# Altium schematic sheet Buck_5V_line_07.SchDoc
size A2; SheetNumber: 6; SheetTotal: 9
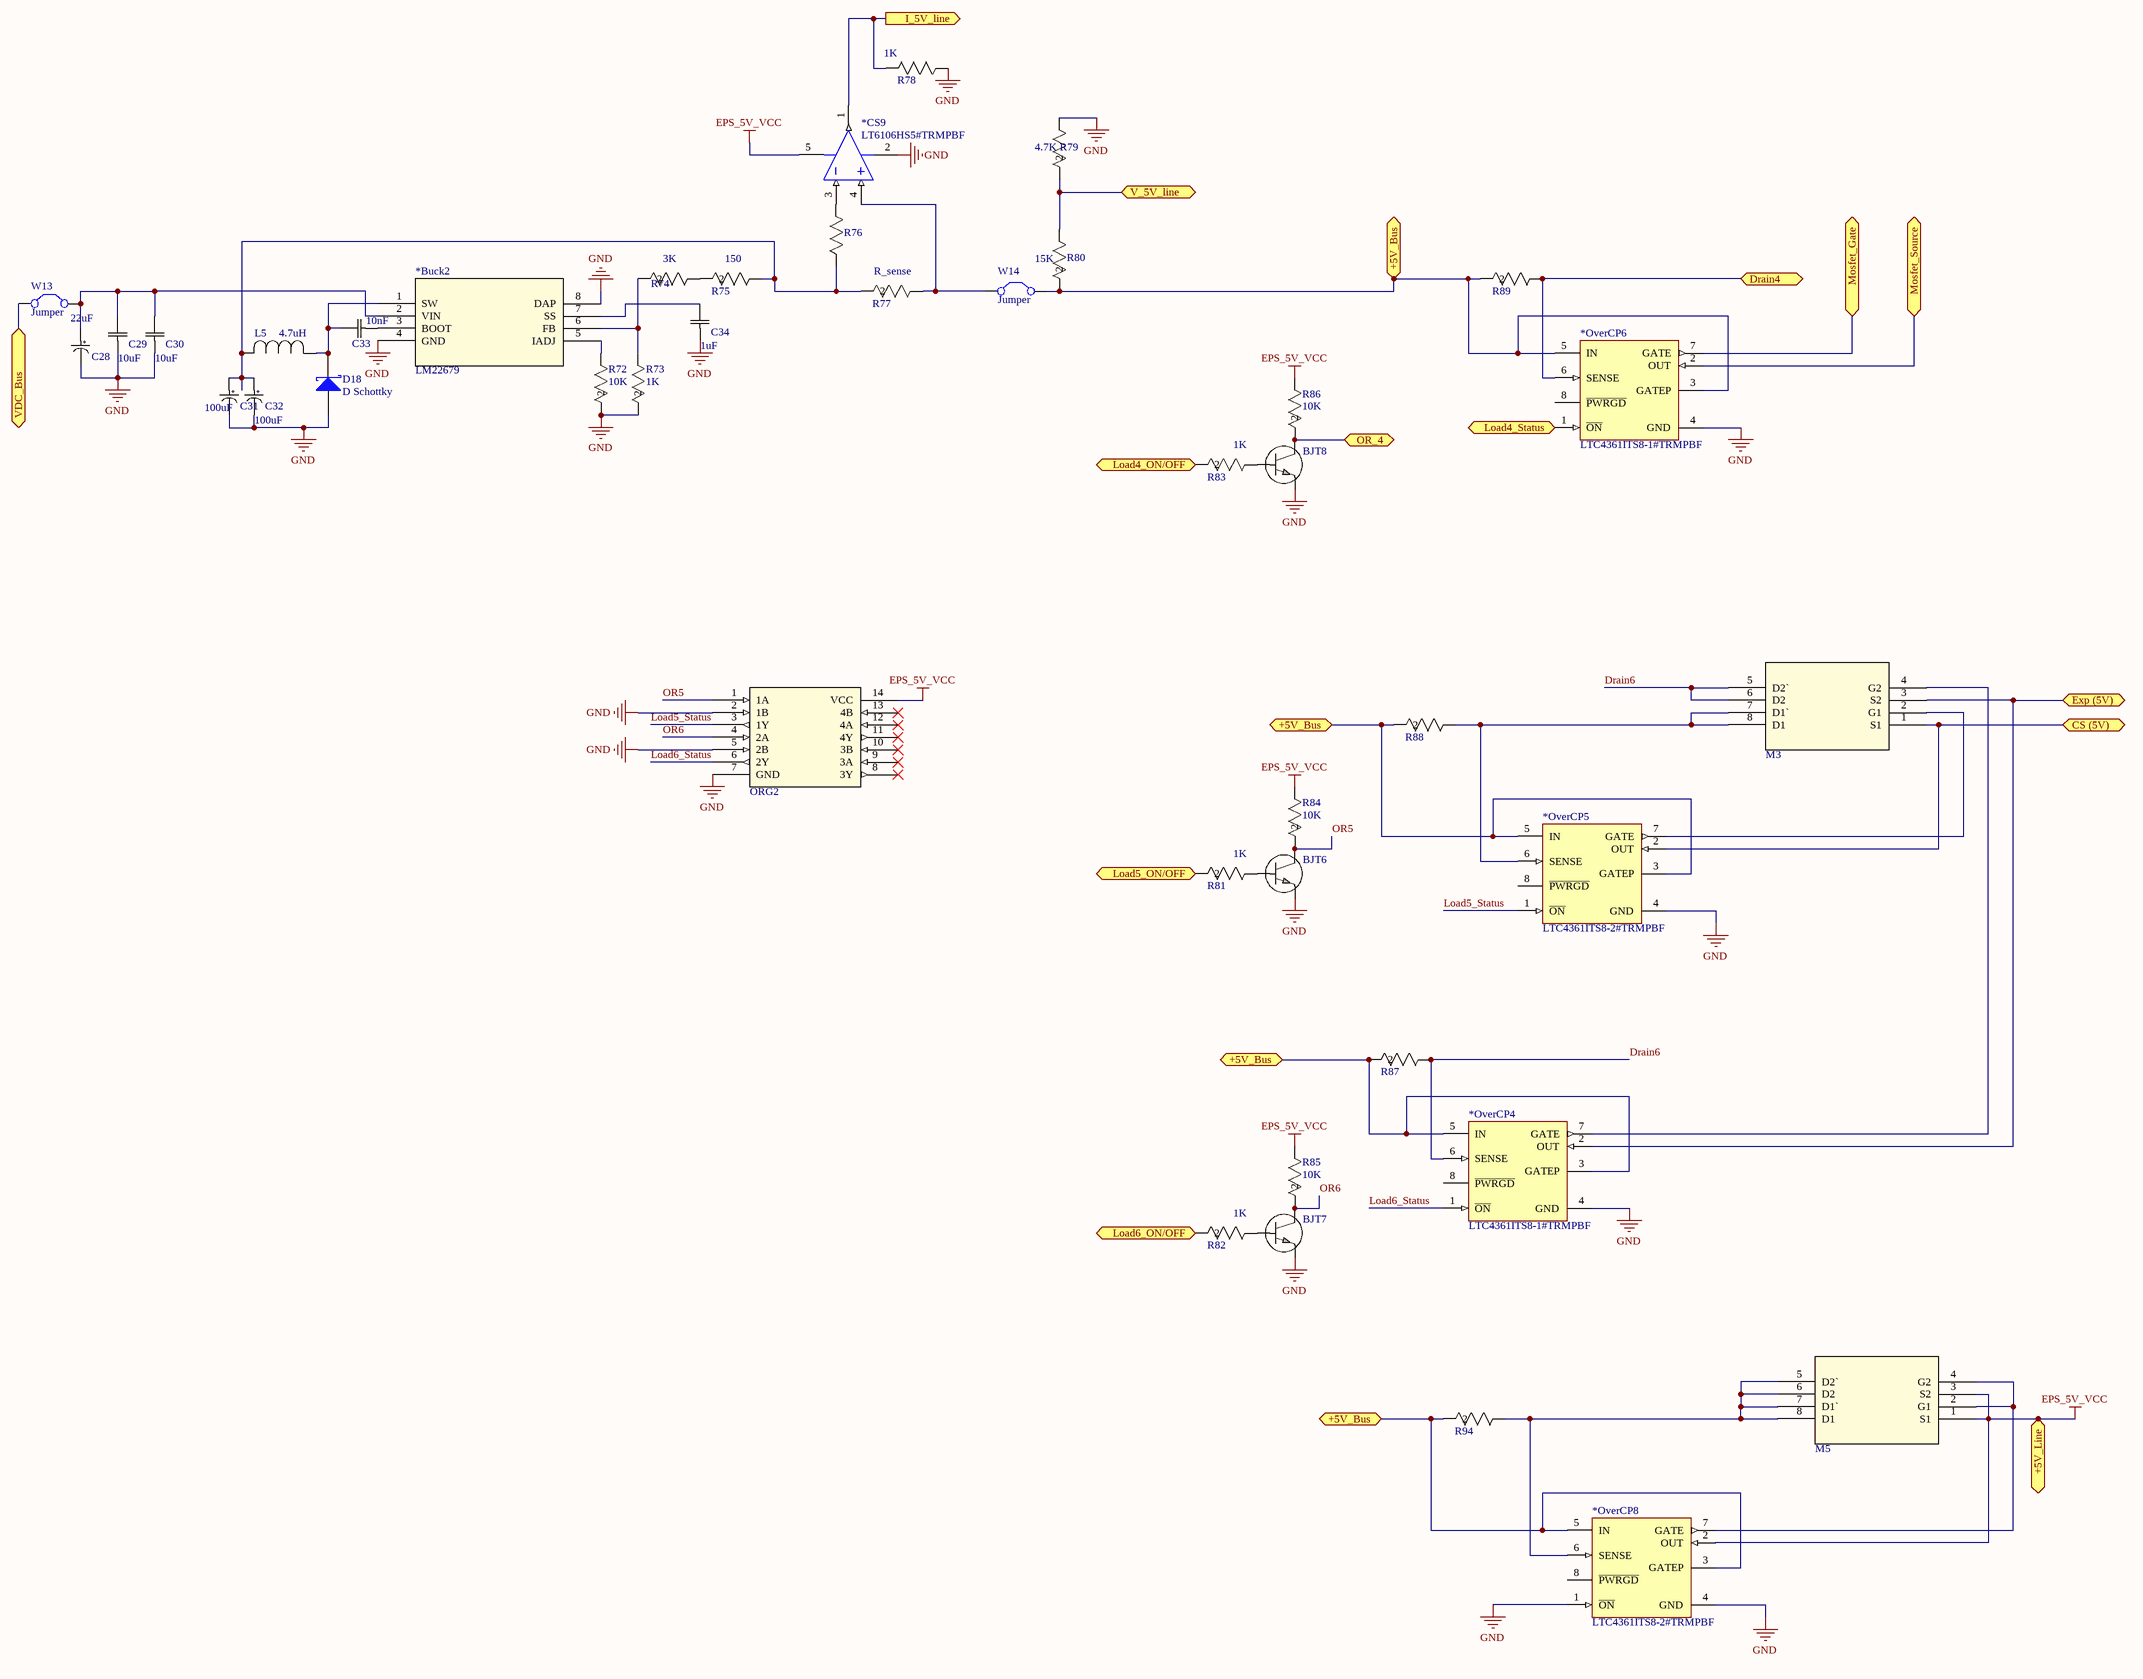
[diagram p0: Buck_5V_line_07.SchDoc]

## Parts
*Buck2  LM22679  [TJ7A-M]
*CS9  LT6106HS5#TRMPBF  [LT-S5-5-TSOT-23_N]
*OverCP4  LTC4361ITS8-1#TRMPBF  [LT-TS8-8-TSOT-23_V]
*OverCP5  LTC4361ITS8-2#TRMPBF  [LT-TS8-8-TSOT-23_V]
*OverCP6  LTC4361ITS8-1#TRMPBF  [LT-TS8-8-TSOT-23_V]
*OverCP8  LTC4361ITS8-2#TRMPBF  [LT-TS8-8-TSOT-23_V]
BJT6  MMBT2222A  [SOT-23A_L]  (value not drawn)
BJT7  MMBT2222A  [SOT-23A_L]  (value not drawn)
BJT8  MMBT2222A  [SOT-23A_L]  (value not drawn)
C28  22uF  [TAJB]
C29  10uF  [RC0805N]
C30  10uF  [RC0805N]
C31  100uF  [TAJB]
C32  100uF  [TAJB]
C33  10nF  [RC0805N]
C34  1uF  [RC0805N]
D18  D Schottky  [SMB]
L5  4.7uH  [IND_SPM6530]
M3  IRF7329TRPBF  [SO8_L]  (value not drawn)
M5  IRF7329TRPBF  [SO8_L]  (value not drawn)
ORG2  SN74LV32ADR  [D14-M]  (value not drawn)
R72  10K  [RC0805N]
R73  1K  [RC0805N]
R74  3K  [RC0805N]
R75  150  [RC0805N]
R76  1K  [RC0805N]  (value not drawn)
R77  R_sense  [RC0805N]
R78  1K  [RC0805N]
R79  4.7K  [RC0805N]
R80  15K  [RC0805N]
R81  1K  [RC0805N]
R82  1K  [RC0805N]
R83  1K  [RC0805N]
R84  10K  [RC0805N]
R85  10K  [RC0805N]
R86  10K  [RC0805N]
R87  RL0805FR-070R1L  [RC0805N]  (value not drawn)
R88  RL0805FR-070R1L  [RC0805N]  (value not drawn)
R89  RL0805FR-070R1L  [RC0805N]  (value not drawn)
R94  RL0805FR-070R1L  [RC0805N]  (value not drawn)
W13  Jumper  [RAD-0.1]
W14  Jumper  [RAD-0.1]

## Ports
+5V_Bus, +5V_Line, CS (5V), Drain4, Exp (5V), I_5V_line (out), Load4_ON/OFF (out), Load4_Status, Load5_ON/OFF (in), Load6_ON/OFF (in), Mosfet_Gate, Mosfet_Source, OR_4, V_5V_line, VDC_Bus

## Nets
EPS_5V_VCC: *CS9.5(V+) *OverCP8.2(OUT) M5.1(S1) M5.3(S2) ORG2.14(VCC) R84.1 R85.1 R86.1 ; port +5V_Line
GND: *Buck2.4(GND) *Buck2.8(DAP) *CS9.2(V-) *OverCP4.4(GND) *OverCP5.4(GND) *OverCP6.4(GND) *OverCP8.1(~{ON}) *OverCP8.4(GND) BJT6.3(E) BJT7.3(E) BJT8.3(E) C28.2 C29.1 C30.1 C31.2 C32.2 C34.1 D18.1(A) ORG2.2(1B) ORG2.5(2B) ORG2.7(GND) R72.2 R73.2 R78.2 R79.1
+5V_Bus: *OverCP4.3(GATEP) *OverCP4.5(IN) *OverCP5.3(GATEP) *OverCP5.5(IN) *OverCP6.3(GATEP) *OverCP6.5(IN) *OverCP8.3(GATEP) *OverCP8.5(IN) R80.2 R87.2 R88.2 R89.2 R94.2 W14.2(C2) ; port +5V_Bus
CS (5V): *OverCP5.2(OUT) M3.1(S1) ; port CS (5V)
Drain4: *OverCP6.6(SENSE) R89.1 ; port Drain4
Drain6: *OverCP4.6(SENSE) M3.5(D2`) M3.6(D2) R87.1
Exp (5V): *OverCP4.2(OUT) M3.3(S2) ; port Exp (5V)
I_5V_line: *CS9.1(OUT) R78.1 ; port I_5V_line
Load4_ON/OFF: R83.2 ; port Load4_ON/OFF
Load4_Status: *OverCP6.1(~{ON}) ; port Load4_Status
Load5_ON/OFF: R81.2 ; port Load5_ON/OFF
Load5_Status: *OverCP5.1(~{ON}) ORG2.3(1Y)
Load6_ON/OFF: R82.2 ; port Load6_ON/OFF
Load6_Status: *OverCP4.1(~{ON}) ORG2.6(2Y)
Mosfet_Gate: *OverCP6.7(GATE) ; port Mosfet_Gate
Mosfet_Source: *OverCP6.2(OUT) ; port Mosfet_Source
OR5: BJT6.2(C) ORG2.1(1A) R84.2
OR6: BJT7.2(C) ORG2.4(2A) R85.2
OR_4: BJT8.2(C) R86.2 ; port OR_4
V_5V_line: R79.2 R80.1 ; port V_5V_line
VDC_Bus: W13.1(C1) ; port VDC_Bus
Net*Buck2_1: *Buck2.1(SW) C33.2 D18.2(K) L5.1
Net*Buck2_2: *Buck2.2(VIN) C28.1 C29.2 C30.2 W13.2(C2)
Net*Buck2_3: *Buck2.3(BOOT) C33.1
Net*Buck2_5: *Buck2.5(IADJ) R72.1
Net*Buck2_6: *Buck2.6(FB) R73.1 R74.2
Net*Buck2_7: *Buck2.7(SS) C34.2
Net*CS9_3: *CS9.3(-IN) R76.1
Net*CS9_4: *CS9.4(+IN) R77.1 W14.1(C1)
Net*OverCP4_7: *OverCP4.7(GATE) M3.4(G2)
Net*OverCP5_6: *OverCP5.6(SENSE) M3.7(D1`) M3.8(D1) R88.1
Net*OverCP5_7: *OverCP5.7(GATE) M3.2(G1)
Net*OverCP8_6: *OverCP8.6(SENSE) M5.5(D2`) M5.6(D2) M5.7(D1`) M5.8(D1) R94.1
Net*OverCP8_7: *OverCP8.7(GATE) M5.2(G1) M5.4(G2)
NetBJT6_1: BJT6.1(B) R81.1
NetBJT7_1: BJT7.1(B) R82.1
NetBJT8_1: BJT8.1(B) R83.1
NetC31_1: C31.1 C32.1 L5.2 R75.1 R76.2 R77.2
NetR74_1: R74.1 R75.2

Not connected (* = marked no-connect by the designer): *OverCP4 8(~{PWRGD}); *OverCP5 8(~{PWRGD}); *OverCP6 8(~{PWRGD}); *OverCP8 8(~{PWRGD}); ORG2 8(3Y)* 9(3A)* 10(3B)* 11(4Y)* 12(4A)* 13(4B)*

## Library data of the parts
*Buck2 = LM22679: step down converter; Manufacturer_Part_Number: lm22679tj-adjnopb; Vendor: National Semiconductor; C: Copyright (C) 2015 Accelerated Designs. All rights reserved; Copyright: Copyright (C) 2015 Accelerated Designs. All rights reserved; Value: Value; Type: Type; RefDes: RefDes
*CS9 = LT6106HS5#TRMPBF: Single Channel, Low Cost, High Side Current Sense Operational Amplifier, 0.2 MHz Typical GBW, 5-Pin SOT-23 (S5-5), High Temperature / Automotive, Pb-Free, Mini Reel; Linear Technology Part Number: LT6106; Manufacturer: Linear Technology; Channels (#): 1; GBW (MHz) Typical: 0.2; Is (mA) Typical: 0.06; Vos (mV) Guaranteed: 0.25; Vos (mV) Typical: 0.15; Vs Max (V): 36; Vs Min (V): 2.7; DatasheetVersion: Rev. A; PackageReference: LT-S5-5-TSOT-23; PackageDescription: 5-Lead Plastic TSOT-23, Body 1.63 x 2.90 mm, Pitch 0.95 mm; Supplier 1: Digi-Key; Supplier Part Number 1: LT6106HS5#TRMPBFTR-ND; Supplier 2: Digi-Key; Supplier Part Number 2: LT6106HS5#TRMPBFCT-ND; Supplier 3: Digi-Key; Supplier Part Number 3: LT6106HS5#TRMPBFDKR-ND; Supplier 4: Farnell; Supplier Part Number 4: 1663842; Supplier 5: Farnell; Supplier Part Number 5: 1663842RL; Supplier 6: Newark; Supplier Part Number 6: 57M9138; Packing: Mini Reel; RoHS: Pb-Free; Type: CSA; Mounting Technology: Surface Mount; Code_JEDEC: MO-193; PartNumber: LT6106HS5#TRMPBF; ComponentLink1Description: Manufacturer URL; ComponentLink1URL: http://www.linear.com/; ComponentLink2Description: Datasheet; ComponentLink2URL: http://cds.linear.com/docs/en/datasheet/6106fa.pdf; ComponentLink3Description: Package Specification; ComponentLink3URL: http://cds.linear.com/docs/en/packaging/SOT_5_05-08-1635.pdf
*OverCP4-*OverCP6 *OverCP8 = LTC4361ITS8-1#TRMPBF: Overvoltage / Overcurrent Protection Controller, 2.5 to 80 V Vin, 8-pin SOT23 (TS8-8), -40 to 85 degC, Pb-Free, Mini Tape and Reel; Manufacturer: Linear Technology; Active Limiting: no; Circuit Breaker Accuracy(%): 10; Circuit Breaker Threshold: 50 mV; Circuit Breakers(#): 1; Extended Temp: C, I, H; Power Good: yes; DatasheetVersion: Rev. B; PackageVersion: Rev. A, 08/2010; PackageReference: TS8-8; PackageDescription: 8-Pin Plastic TSOT-23, Body 2.9 x 1.63 mm, Pitch 0.65 mm; Supplier 1: Digi-Key; Supplier Part Number 1: LTC4361ITS8-1#TRMPBFTR-ND; Supplier 2: Digi-Key; Supplier Part Number 2: LTC4361ITS8-1#TRMPBFCT-ND; Supplier 3: Digi-Key; Supplier Part Number 3: LTC4361ITS8-1#TRMPBFDKR-ND; Fast Comparator: no; Fault: no; Foldback: no; Packing: Mini Tape and Reel; Reset: no; RoHS: TRUE; Vin Range: 2.5 to 80 V; Mounting Technology: Surface Mount; Code_JEDEC: MO-193; PartNumber: LTC4361ITS8-1#TRMPBF; ComponentLink1Description: Manufacturer URL; ComponentLink1URL: http://www.linear.com/; ComponentLink2Description: Datasheet; ComponentLink2URL: http://cds.linear.com/docs/en/datasheet/436112fb.pdf; ComponentLink3Description: Package Specification; ComponentLink3URL: http://cds.linear.com/docs/en/packaging/SOT_8_05-08-1637.pdf
BJT6-BJT8 = 2STF1360: BJT; Vendor: ST Microelectronics; Transistor_Type: NPN; Current_-_Collector_(Ic)_(Max): 3A; Voltage_-_Collector_Emitter_Breakdown_(Max): 60V; Vce_Saturation_(Max)_@_Ib,_Ic: 500mV @ 150mA, 3A; DC_Current_Gain_(hFE)_(Min)_@_Ic,_Vce: 160 @ 1A, 2V; Power_-_Max: 1.4W; Frequency_-_Transition: 130MHz; Mounting_Type: Surface Mount; C: Copyright (C) 2015 Accelerated Designs. All rights reserved; Manufacturer_Part_Number: 2STF1360; DigiKeyPartNumber: 497-5211-2-ND; Quantity_Available: 5000; Copyright: Copyright (C) 2015 Accelerated Designs. All rights reserved; DataSheet: http://www.st.com/internet/com/TECHNICAL_RESOURCES/TECHNICAL_LITERATURE/DATASHEET/CD00073146.pdf; Current_-_Collector_Cutoff_(Max): -; Package_/_Case: TO-243AA; Supplier_Device_Package: SOT-89-3; Packaging: Tape &amp; Reel (TR); Value: Value
C28 = TAJB226M010RNJ: Tantalum Capacitor, 22uF; Vendor: AVX Corporation; C: Copyright (C) 2015 Accelerated Designs. All rights reserved; Copyright: Copyright (C) 2015 Accelerated Designs. All rights reserved; Manufacturer_Part_Number: TAJB226M010RNJ; Value: Value; Package/Case: 1411 (3528 metric)
C29 C30 = C0805C106K8PACTU: Ceramic Capacitor 10uF; Vendor: Kemet; Capacitance: 10ÂµF; Voltage_-_Rated: 10V; Tolerance: Â±10%; Temperature_Coefficient: X5R; Operating_Temperature: -55Â°C ~ 85Â°C; Mounting_Type: Surface Mount, MLCC; Thickness_(Max): 0.055" (1.40mm); C: Copyright (C) 2015 Accelerated Designs. All rights reserved; DigiKeyPartNumber: 399-4925-2-ND; Manufacturer_Part_Number: C0805C106K8PACTU; Quantity_Available: 660000; Copyright: Copyright (C) 2015 Accelerated Designs. All rights reserved; DataSheet: http://www.kemet.com/datasheets&amp;C0805C106K8PACTU; Package_/_Case: 0805 (2012 Metric); Packaging: Tape &amp; Reel (TR); Features: -; Lead_Spacing: -; Series: -; Thickness: 1.25mm; NewarkPartNumber: 58M4436; Applications: General Purpose; Ratings: -; Size_/_Dimension: 0.079" L x 0.049" W (2.00mm x 1.25mm); Height_-_Seated_(Max): -; Lead_Style: -; Value: Value
C31 = TAJB226M010RNJ: Tantalum Capacitor, 100uF; Vendor: AVX Corporation; C: Copyright (C) 2015 Accelerated Designs. All rights reserved; Copyright: Copyright (C) 2015 Accelerated Designs. All rights reserved; Manufacturer_Part_Number: TAJB226M010RNJ; Value: Value; Package/Case: 1411 (3528 metric)
C32 = TAJB226M010RNJ: Tantalum Capacitor,100uF; Vendor: AVX Corporation; C: Copyright (C) 2015 Accelerated Designs. All rights reserved; Copyright: Copyright (C) 2015 Accelerated Designs. All rights reserved; Manufacturer_Part_Number: TAJB226M010RNJ; Value: Value; Package/Case: 1411 (3528 metric)
C33 = GRM155R71H103KA8: Ceramic Capacitor 10nF; Manufacturer_Part_Number: GRM155R71H103KA88D; Vendor: Murata; C: Copyright (C) 2015 Accelerated Designs. All rights reserved; Copyright: Copyright (C) 2015 Accelerated Designs. All rights reserved; Value: Value
C34 = GRM188R61C105KA9: Ceramic Capacitor 1uF; Manufacturer_Part_Number: GRM188R61C105KA93D; Vendor: Murata; C: Copyright (C) 2015 Accelerated Designs. All rights reserved; Copyright: Copyright (C) 2015 Accelerated Designs. All rights reserved; Value: Value; Package/Case: 0603 (1608 Metric)
D18 = D Schottky: Schottky Diode, 1A; Published: 8-Jun-2000; LatestRevisionDate: 17-Jul-2002; LatestRevisionNote: Re-released for DXP Platform.; PackageReference: SMB; Publisher: Altium Limited; PackageDescription: DO-214-AA/SMB; 2 C-Bend Leads; Body 5.3 x 3.6 mm, inc. leads (LxW); Code_JEDEC: DO-214-AA
L5 = SPM6530T-4R7M: Inductor, 4.7uH; Vendor: TDK; C: Copyright (C) 2015 Accelerated Designs. All rights reserved; Manufacturer_Part_Number: SPM6530T-4R7M; Copyright: Copyright (C) 2015 Accelerated Designs. All rights reserved; Value: Value
M3 M5 = IRF7329TRPBF: P-MOSFET, DUAL PCh -12V 9.2A; Manufacturer: Infineon / IR; Number of Channels: 2 Channels; Manufacturer Part No: IRF7329TRPBF; Package/Case: SO-8; Mouser Part No: 942-IRF7329TRPBF
ORG2 = SN74LV32ADR: OR GATE, 4 Channels; Manufacturer: Texas Instruments; INDUSTRY_STD_PKG_TYPE: SOIC; FAMILY_NAME: OR GATE; PIN_COUNT: 14; PACKAGE_DESIGNATOR: D; 3D_Library_Name: TI_AllParts_2012-12-25; C: Copyright (C) 2015 Accelerated Designs. All rights reserved; Datasheet_URL: http://www.ti.com/lit/gpn/SN74LV32A; Copyright: Copyright (C) 2015 Accelerated Designs. All rights reserved; GENERIC_PART_NUMBER: SN74LV32A; Vendor: Texas Instruments; Manufacturer_Part_Number: SN74LV32ADR; Value: Value; Type: Type; RefDes: RefDes
R72 R84-R86 = RC0805FR: Thick Film Resistors, 10k ohm; Manufacturer_Part_Number: RC0805FR-074K7L; Vendor: Yageo; Resistance_In_Ohms: 4.70K; Power_(Watts): 0.125W, 1/8W; Tolerance: Â±1%; Lead_Style: Surface Mount (SMD - SMT); Voltage_-_Working: 150V; Temperature_Coefficient: Â±100ppm/Â°C; Resistance_(Ohms): 4.7K; Number_of_Terminations: 2; C: Copyright (C) 2015 Accelerated Designs. All rights reserved; DigiKeyPartNumber: 311-4.70KCRTR-ND; Quantity_Available: 0; Copyright: Copyright (C) 2015 Accelerated Designs. All rights reserved; DataSheet: http://www.yageo.com/documents/recent/PYu-RC0805_51_RoHS_L_4.pdf; Case: 0805 (2012 metric); Packaging: Tape &amp; Reel (TR); Composition: Thick Film; NewarkPartNumber: 10R0398; Features: -; Package_/_Case: 0805 (2012 Metric); Size_/_Dimension: 0.079" L x 0.049" W (2.00mm x 1.25mm); Height: 0.024" (0.60mm); Value: Value
R73 R81-R83 = RC0805FR: Thick Film Resistors, 1k ohm; Manufacturer_Part_Number: RC0805FR-074K7L; Vendor: Yageo; Resistance_In_Ohms: 4.70K; Power_(Watts): 0.125W, 1/8W; Tolerance: Â±1%; Lead_Style: Surface Mount (SMD - SMT); Voltage_-_Working: 150V; Temperature_Coefficient: Â±100ppm/Â°C; Resistance_(Ohms): 4.7K; Number_of_Terminations: 2; C: Copyright (C) 2015 Accelerated Designs. All rights reserved; DigiKeyPartNumber: 311-4.70KCRTR-ND; Quantity_Available: 0; Copyright: Copyright (C) 2015 Accelerated Designs. All rights reserved; DataSheet: http://www.yageo.com/documents/recent/PYu-RC0805_51_RoHS_L_4.pdf; Case: 0805 (2012 metric); Packaging: Tape &amp; Reel (TR); Composition: Thick Film; NewarkPartNumber: 10R0398; Features: -; Package_/_Case: 0805 (2012 Metric); Size_/_Dimension: 0.079" L x 0.049" W (2.00mm x 1.25mm); Height: 0.024" (0.60mm); Value: Value
R74 = RC0805FR: Thick Film Resistors, 3k ohm; Manufacturer_Part_Number: RC0805FR-074K7L; Vendor: Yageo; Resistance_In_Ohms: 4.70K; Power_(Watts): 0.125W, 1/8W; Tolerance: Â±1%; Lead_Style: Surface Mount (SMD - SMT); Voltage_-_Working: 150V; Temperature_Coefficient: Â±100ppm/Â°C; Resistance_(Ohms): 4.7K; Number_of_Terminations: 2; C: Copyright (C) 2015 Accelerated Designs. All rights reserved; DigiKeyPartNumber: 311-4.70KCRTR-ND; Quantity_Available: 0; Copyright: Copyright (C) 2015 Accelerated Designs. All rights reserved; DataSheet: http://www.yageo.com/documents/recent/PYu-RC0805_51_RoHS_L_4.pdf; Case: 0805 (2012 metric); Packaging: Tape &amp; Reel (TR); Composition: Thick Film; NewarkPartNumber: 10R0398; Features: -; Package_/_Case: 0805 (2012 Metric); Size_/_Dimension: 0.079" L x 0.049" W (2.00mm x 1.25mm); Height: 0.024" (0.60mm); Value: Value
R75 = RC0805FR: Thick Film Resistors, 150 ohm; Manufacturer_Part_Number: RC0805FR-074K7L; Vendor: Yageo; Resistance_In_Ohms: 4.70K; Power_(Watts): 0.125W, 1/8W; Tolerance: Â±1%; Lead_Style: Surface Mount (SMD - SMT); Voltage_-_Working: 150V; Temperature_Coefficient: Â±100ppm/Â°C; Resistance_(Ohms): 4.7K; Number_of_Terminations: 2; C: Copyright (C) 2015 Accelerated Designs. All rights reserved; DigiKeyPartNumber: 311-4.70KCRTR-ND; Quantity_Available: 0; Copyright: Copyright (C) 2015 Accelerated Designs. All rights reserved; DataSheet: http://www.yageo.com/documents/recent/PYu-RC0805_51_RoHS_L_4.pdf; Case: 0805 (2012 metric); Packaging: Tape &amp; Reel (TR); Composition: Thick Film; NewarkPartNumber: 10R0398; Features: -; Package_/_Case: 0805 (2012 Metric); Size_/_Dimension: 0.079" L x 0.049" W (2.00mm x 1.25mm); Height: 0.024" (0.60mm); Value: Value
R76 = RC0805FR: Thick Film Resistors 0805; Manufacturer_Part_Number: RC0805FR-074K7L; Vendor: Yageo; Power_(Watts): 0.125W, 1/8W; Tolerance: Â±1%; Lead_Style: Surface Mount (SMD - SMT); Voltage_-_Working: 150V; Temperature_Coefficient: Â±100ppm/Â°C; Number_of_Terminations: 2; C: Copyright (C) 2015 Accelerated Designs. All rights reserved; DigiKeyPartNumber: 311-4.70KCRTR-ND; Quantity_Available: 0; Copyright: Copyright (C) 2015 Accelerated Designs. All rights reserved; DataSheet: http://www.yageo.com/documents/recent/PYu-RC0805_51_RoHS_L_4.pdf; Resistance_In_Ohms: 1K; Case: 0805 (2012 metric); Packaging: Tape &amp; Reel (TR); Composition: Thick Film; NewarkPartNumber: 10R0398; Resistance_(Ohms): 1K; Features: -; Package_/_Case: 0805 (2012 Metric); Size_/_Dimension: 0.079" L x 0.049" W (2.00mm x 1.25mm); Height: 0.024" (0.60mm); Value: Value
R77 R87-R89 R94 = RL0805FR-070R1L: Sense Resistor 100m ohm 0805; Vendor: Yageo; Resistance_In_Ohms: 0.10; Power_(Watts): 0.125W, 1/8W; Tolerance: Â±1%; Lead_Style: Surface Mount (SMD - SMT); Voltage_-_Working: 300V; Temperature_Coefficient: Â±600ppm/Â°C; Resistance_(Ohms): 0.1; Number_of_Terminations: 2; C: Copyright (C) 2015 Accelerated Designs. All rights reserved; DigiKeyPartNumber: 311-.10STR-ND; Manufacturer_Part_Number: RL0805FR-070R1L; Quantity_Available: 25000; Copyright: Copyright (C) 2015 Accelerated Designs. All rights reserved; DataSheet: http://www.yageo.com/documents/recent/PYu-RL_521_RoHS_L_5.pdf; Case: 0805 (2012 metric); Packaging: Tape &amp; Reel (TR); Composition: Thick Film; NewarkPartNumber: 66R6321; Features: Current Sense; Package_/_Case: 0805 (2012 Metric); Size_/_Dimension: 0.079" L x 0.049" W (2.00mm x 1.25mm); Height: 0.024" (0.60mm); Value: Value
R78 = RC0805FR: Thick Film Resistors 0805; Manufacturer_Part_Number: RC0805FR-074K7L; Vendor: Yageo; Resistance_In_Ohms: 4.70K; Power_(Watts): 0.125W, 1/8W; Tolerance: Â±1%; Lead_Style: Surface Mount (SMD - SMT); Voltage_-_Working: 150V; Temperature_Coefficient: Â±100ppm/Â°C; Resistance_(Ohms): 4.7K; Number_of_Terminations: 2; C: Copyright (C) 2015 Accelerated Designs. All rights reserved; DigiKeyPartNumber: 311-4.70KCRTR-ND; Quantity_Available: 0; Copyright: Copyright (C) 2015 Accelerated Designs. All rights reserved; DataSheet: http://www.yageo.com/documents/recent/PYu-RC0805_51_RoHS_L_4.pdf; Case: 0805 (2012 metric); Packaging: Tape &amp; Reel (TR); Composition: Thick Film; NewarkPartNumber: 10R0398; Features: -; Package_/_Case: 0805 (2012 Metric); Size_/_Dimension: 0.079" L x 0.049" W (2.00mm x 1.25mm); Height: 0.024" (0.60mm); Value: Value
R79 = RC0805FR: Resistors 0805, 4.7k ohm; Manufacturer_Part_Number: RC0805FR-074K7L; Vendor: Yageo; Resistance_In_Ohms: 4.70K; Power_(Watts): 0.125W, 1/8W; Tolerance: Â±1%; Lead_Style: Surface Mount (SMD - SMT); Voltage_-_Working: 150V; Temperature_Coefficient: Â±100ppm/Â°C; Number_of_Terminations: 2; C: Copyright (C) 2015 Accelerated Designs. All rights reserved; DigiKeyPartNumber: 311-4.70KCRTR-ND; Quantity_Available: 0; Copyright: Copyright (C) 2015 Accelerated Designs. All rights reserved; DataSheet: http://www.yageo.com/documents/recent/PYu-RC0805_51_RoHS_L_4.pdf; Case: 0805 (2012 metric); Packaging: Tape &amp; Reel (TR); Composition: Thick Film; NewarkPartNumber: 10R0398; Resistance_(Ohms): 4.7K; Features: -; Package_/_Case: 0805 (2012 Metric); Size_/_Dimension: 0.079" L x 0.049" W (2.00mm x 1.25mm); Height: 0.024" (0.60mm); Value: Value
R80 = RC0805FR: Resistors 0805, 15k ohm; Manufacturer_Part_Number: RC0805FR-074K7L; Vendor: Yageo; Resistance_In_Ohms: 4.70K; Power_(Watts): 0.125W, 1/8W; Tolerance: Â±1%; Lead_Style: Surface Mount (SMD - SMT); Voltage_-_Working: 150V; Temperature_Coefficient: Â±100ppm/Â°C; Resistance_(Ohms): 4.7K; Number_of_Terminations: 2; C: Copyright (C) 2015 Accelerated Designs. All rights reserved; DigiKeyPartNumber: 311-4.70KCRTR-ND; Quantity_Available: 0; Copyright: Copyright (C) 2015 Accelerated Designs. All rights reserved; DataSheet: http://www.yageo.com/documents/recent/PYu-RC0805_51_RoHS_L_4.pdf; Case: 0805 (2012 metric); Packaging: Tape &amp; Reel (TR); Composition: Thick Film; NewarkPartNumber: 10R0398; Features: -; Package_/_Case: 0805 (2012 Metric); Size_/_Dimension: 0.079" L x 0.049" W (2.00mm x 1.25mm); Height: 0.024" (0.60mm); Value: Value
W13 W14 = Jumper: Jumper Wire; Published: 24-Mar-1999; LatestRevisionDate: 17-Jul-2002; LatestRevisionNote: Re-released for DXP Platform.; PackageReference: RAD-0.2; Publisher: Altium Limited; PackageDescription: Radial Cap, Thru-Hole; 2 Leads; 0.2 in Pin Spacing